# Altium project 6AxisEncoderFinARM.PrjPcb
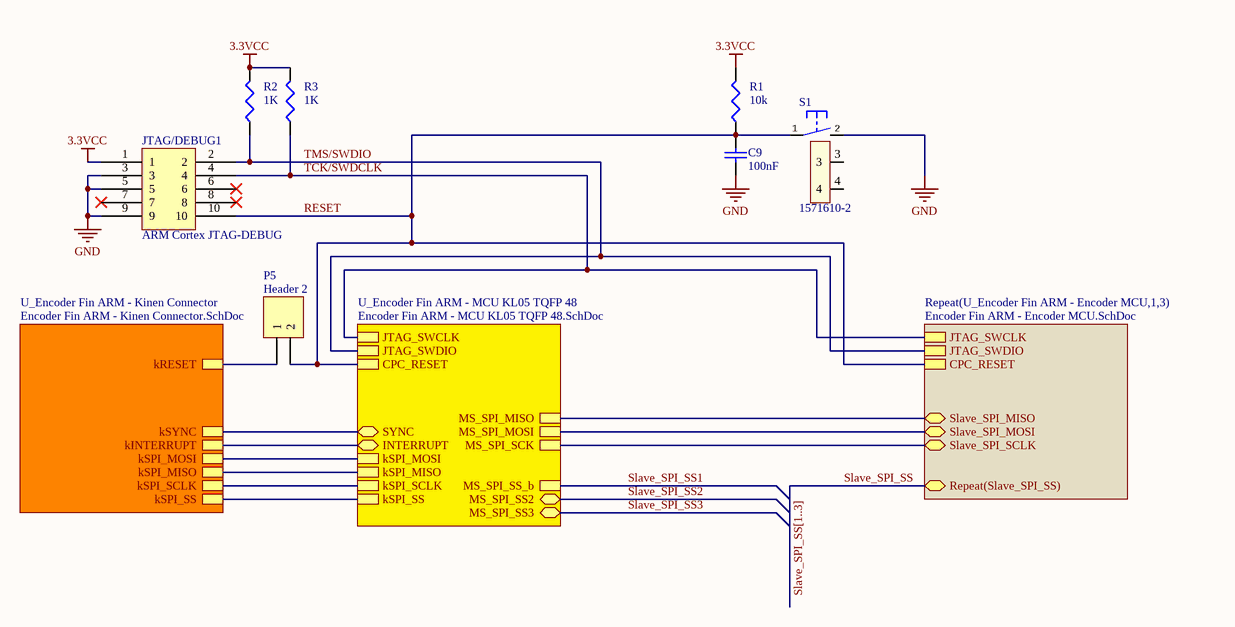
[diagram p0: Encoder Fin ARM - System.SchDoc]
4 sheets, 58 parts. Net scope: hierarchical (ports join the sheet entries above them; power ports are global).
Board file: SixAxisEncoderFinARM R1.0.PcbDoc
Sheets:
  Encoder Fin ARM - System.SchDoc
    U_Encoder Fin ARM - Encoder MCU1 = Encoder Fin ARM - Encoder MCU.SchDoc
    U_Encoder Fin ARM - Encoder MCU2 = Encoder Fin ARM - Encoder MCU.SchDoc
    U_Encoder Fin ARM - Encoder MCU3 = Encoder Fin ARM - Encoder MCU.SchDoc
    U_Encoder Fin ARM - MCU KL05 TQFP 48 = Encoder Fin ARM - MCU KL05 TQFP 48.SchDoc
    U_Encoder Fin ARM - Kinen Connector = Encoder Fin ARM - Kinen Connector.SchDoc

## Sheet Encoder Fin ARM - System.SchDoc
size B

### Parts
C9  value 100nF  [1608[0603]]  (hidden comment: Cap Semi)
JTAG/DEBUG1  ARM Cortex JTAG-DEBUG  [FTSH-105-XX-X-DV]
P5  Header 2  [HDR1X2]
R1  value 10k  [J1-0603]  (hidden comment: Res3)
R2  value 1K  [J1-0603]  (hidden comment: Res3)
R3  value 1K  [J1-0603]  (hidden comment: Res3)
S1  1571610-2  [B3F-31XX]

### Sub-sheets
Repeat(U_Encoder Fin ARM - Encoder MCU,1,3) = Encoder Fin ARM - Encoder MCU.SchDoc: JTAG_SWCLK, JTAG_SWDIO, CPC_RESET, Slave_SPI_MOSI, Slave_SPI_MISO, Slave_SPI_SCLK, Repeat(Slave_SPI_SS)
U_Encoder Fin ARM - Kinen Connector = Encoder Fin ARM - Kinen Connector.SchDoc: kSPI_MOSI, kSPI_MISO, kSPI_SCLK, kSPI_SS, kRESET, kINTERRUPT, kSYNC
U_Encoder Fin ARM - MCU KL05 TQFP 48 = Encoder Fin ARM - MCU KL05 TQFP 48.SchDoc: JTAG_SWCLK, JTAG_SWDIO, CPC_RESET, kSPI_MOSI, kSPI_MISO, kSPI_SCLK, kSPI_SS, MS_SPI_MISO, MS_SPI_SS_b, MS_SPI_MOSI, MS_SPI_SCK, MS_SPI_SS2, MS_SPI_SS3, INTERRUPT, SYNC

### Nets
3.3VCC: JTAG/DEBUG1.1 R1.2 R2.2 R3.2
GND: C9.1 JTAG/DEBUG1.3 JTAG/DEBUG1.5 JTAG/DEBUG1.9 S1.2(S)
kSPI_MISO: sheet U_Encoder Fin ARM - MCU KL05 TQFP 48/kSPI_MISO, sheet U_Encoder Fin ARM - Kinen Connector/kSPI_MISO
kSPI_MOSI: sheet U_Encoder Fin ARM - MCU KL05 TQFP 48/kSPI_MOSI, sheet U_Encoder Fin ARM - Kinen Connector/kSPI_MOSI
kSPI_SCLK: sheet U_Encoder Fin ARM - MCU KL05 TQFP 48/kSPI_SCLK, sheet U_Encoder Fin ARM - Kinen Connector/kSPI_SCLK
kSPI_SS: sheet U_Encoder Fin ARM - MCU KL05 TQFP 48/kSPI_SS, sheet U_Encoder Fin ARM - Kinen Connector/kSPI_SS
RESET: C9.2 JTAG/DEBUG1.10 P5.2 R1.1 S1.1(P) ; sheet Repeat(U_Encoder Fin ARM - Encoder MCU,1,3)/CPC_RESET, sheet U_Encoder Fin ARM - MCU KL05 TQFP 48/CPC_RESET
Slave_SPI_SS: sheet Repeat(U_Encoder Fin ARM - Encoder MCU,1,3)/Repeat(Slave_SPI_SS)
TCK/SWDCLK: JTAG/DEBUG1.4 R3.1 ; sheet Repeat(U_Encoder Fin ARM - Encoder MCU,1,3)/JTAG_SWCLK, sheet U_Encoder Fin ARM - MCU KL05 TQFP 48/JTAG_SWCLK
TMS/SWDIO: JTAG/DEBUG1.2 R2.1 ; sheet Repeat(U_Encoder Fin ARM - Encoder MCU,1,3)/JTAG_SWDIO, sheet U_Encoder Fin ARM - MCU KL05 TQFP 48/JTAG_SWDIO
NetK1_11: P5.1 ; sheet U_Encoder Fin ARM - Kinen Connector/kRESET
NetK1_13: sheet U_Encoder Fin ARM - MCU KL05 TQFP 48/SYNC, sheet U_Encoder Fin ARM - Kinen Connector/kSYNC
NetK1_14: sheet U_Encoder Fin ARM - MCU KL05 TQFP 48/INTERRUPT, sheet U_Encoder Fin ARM - Kinen Connector/kINTERRUPT
NetU1A_8: sheet Repeat(U_Encoder Fin ARM - Encoder MCU,1,3)/Slave_SPI_MOSI, sheet U_Encoder Fin ARM - MCU KL05 TQFP 48/MS_SPI_MOSI
NetU1A_11: sheet Repeat(U_Encoder Fin ARM - Encoder MCU,1,3)/Slave_SPI_MISO, sheet U_Encoder Fin ARM - MCU KL05 TQFP 48/MS_SPI_MISO
NetU1A_12: sheet Repeat(U_Encoder Fin ARM - Encoder MCU,1,3)/Slave_SPI_SCLK, sheet U_Encoder Fin ARM - MCU KL05 TQFP 48/MS_SPI_SCK

Not connected (* = marked no-connect by the designer): JTAG/DEBUG1 6* 7* 8*; S1 3 4

### Buses and harness runs
bus Slave_SPI_SS[1..3]

### Library data of the parts
C9 = Cap Semi: Capacitor (Semiconductor SIM Model); Published: 8-Jun-2000; LatestRevisionDate: 29-May-2009; LatestRevisionNote: IPC-7351 Footprint Added.; PackageReference: C1206; Publisher: Altium Limited; PackageDescription: Chip Capacitor
JTAG/DEBUG1 = ARM Cortex JTAG-DEBUG Header
P5 = Header 2: Header, 2-Pin; LatestRevisionDate: 17-Jul-2002; LatestRevisionNote: Re-released for DXP Platform.; Publisher: Altium Limited
R1-R3 = Res3: Resistor; Published: 8-Jun-2000; LatestRevisionDate: 29-May-2009; LatestRevisionNote: IPC-7351 Footprint Added.; PackageReference: J1-0603; Publisher: Altium Limited; PackageDescription: Chip Resistor
S1 = 1571610-2_1: SWTCH Momentary Washable; Manufacturer: Omron; Manufacturer: TE; LastRevisionNote: Import; ComponentLink1URL: http://www.te.com/commerce/DocumentDelivery/DDEController?Action=srchrtrv&DocNm=1571610&DocType=Customer+Drawing&DocLang=English; ComponentLink1Description: Datasheet for B3F-31XX; Published: 23-Apr-2014; Publisher: UltiMachine; LastRevisionDate: 23-Apr-2014; ManufacturerPartNumber: 1571610-2; Supplier 1: Mouser; Supplier Part Number 1: 506-1571610-2

## Sheet Encoder Fin ARM - Encoder MCU.SchDoc
size A
Used 3 times, as channels U_Encoder Fin ARM - Encoder MCU1, U_Encoder Fin ARM - Encoder MCU2, U_Encoder Fin ARM - Encoder MCU3. Parts and nets are listed once, with the designators drawn on the sheet.
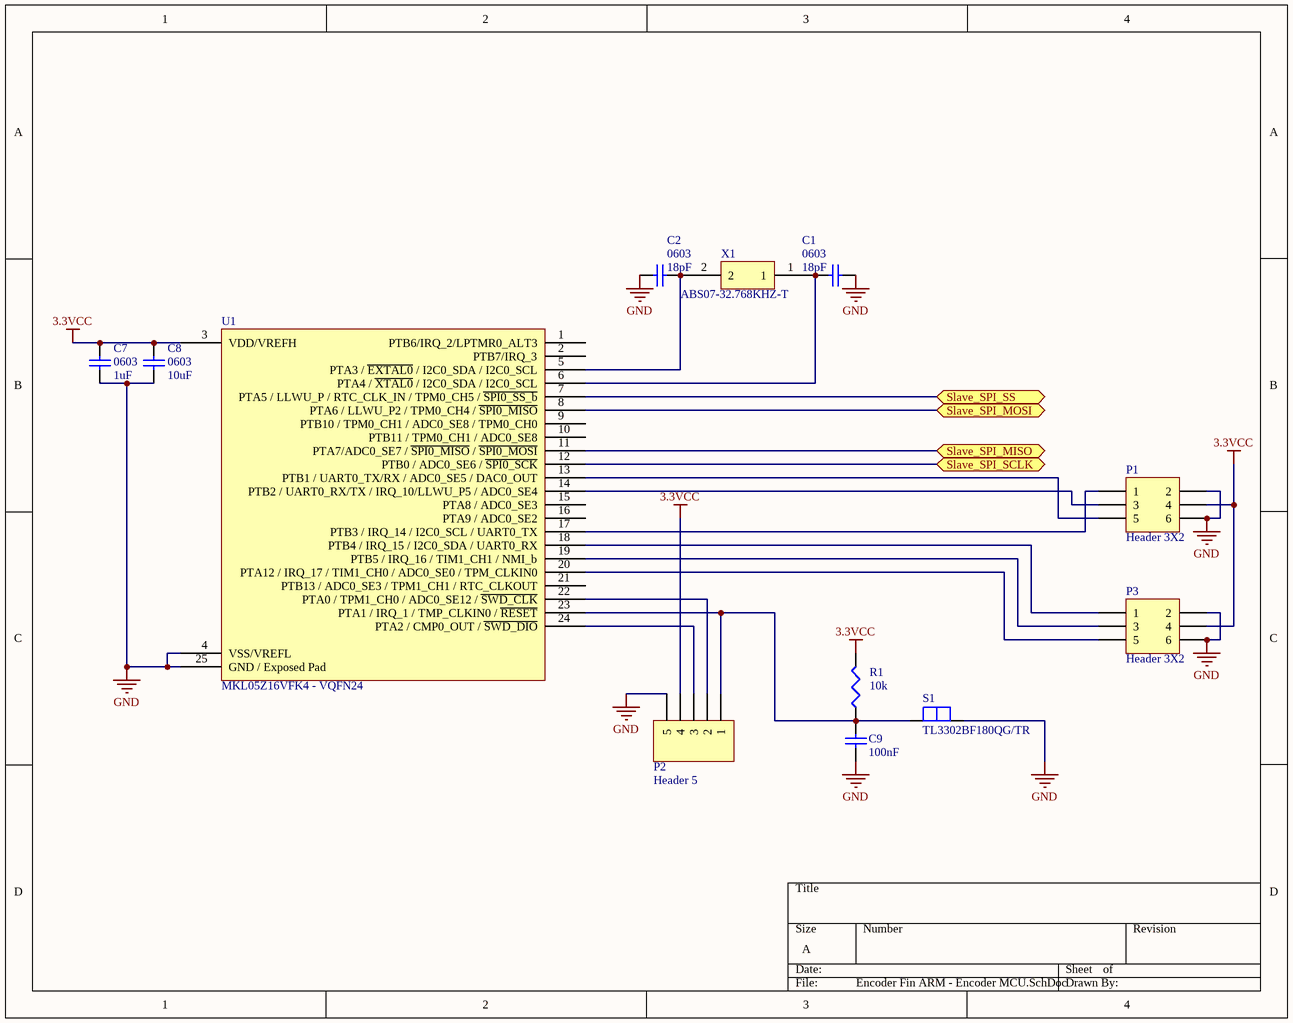
[diagram p1: Encoder Fin ARM - Encoder MCU.SchDoc]

### Parts
C1  0603  value 18pF  [1608[0603]]
C2  0603  value 18pF  [1608[0603]]
C7  0603  value 1uF  [1608[0603]]
C8  0603  value 10uF  [1608[0603]]
C9  value 100nF  [1608[0603]]  (hidden comment: Cap Semi)
P1  Header 3X2  [HDR2X3 Shrouded - Molex 0901301106]
P2  Header 5  [HDR1X5]
P3  Header 3X2  [HDR2X3 Shrouded - Molex 0901301106]
R1  value 10k  [J1-0603]  (hidden comment: Res3)
S1  TL3302BF180QG/TR  [TL3302BF180QG/TR]
U1  MKL05Z16VFK4 - VQFN24  [98ASA00474D]
X1  ABS07-32.768KHZ-T  [ABS07-32.768KHZ-T]

### Ports
Slave_SPI_MISO, Slave_SPI_MOSI, Slave_SPI_SCLK, Slave_SPI_SS

### Nets
3.3VCC: C7.2 C8.2 P1.4 P2.4 P3.4 R1.2 U1.3(VDD/VREFH)
GND: C1.2 C2.2 C7.1 C8.1 C9.1 P1.2 P1.6 P2.5 P3.2 P3.6 S1.2 U1.4(VSS/VREFL) U1.25(GND_/_Exposed_Pad)
Slave_SPI_MISO: U1.11(PTA7/ADC0_SE7_/_~{SPI0_MISO}_/_~{SPI0_MOSI}) ; port Slave_SPI_MISO
Slave_SPI_MOSI: U1.8(PTA6_/_LLWU_P2_/_TPM0_CH4_/_~{SPI0_MISO}) ; port Slave_SPI_MOSI
Slave_SPI_SCLK: U1.12(PTB0_/_ADC0_SE6_/_~{SPI0_SCK}) ; port Slave_SPI_SCLK
Slave_SPI_SS: U1.7(PTA5_/_LLWU_P_/_RTC_CLK_IN_/_TPM0_CH5_/_~{SPI0_SS_b}) ; port Slave_SPI_SS
NetC1_1: C1.1 U1.6(PTA4_/_~{XTAL0}_/_I2C0_SDA_/_I2C0_SCL) X1.1
NetC2_1: C2.1 U1.5(PTA3_/_~{EXTAL0}_/_I2C0_SDA_/_I2C0_SCL) X1.2
NetC9_2: C9.2 P2.1 R1.1 S1.1 U1.23(PTA1_/_IRQ_1_/_TMP_CLKIN0_/_~{RESET})
NetP1_1: P1.1 U1.17(PTB3_/_IRQ_14_/_I2C0_SCL_/_UART0_TX)
NetP1_3: P1.3 U1.14(PTB2_/_UART0_RX/TX_/_IRQ_10/LLWU_P5_/_ADC0_SE4)
NetP1_5: P1.5 U1.13(PTB1_/_UART0_TX/RX_/_ADC0_SE5_/_DAC0_OUT)
NetP2_2: P2.2 U1.22(PTA0_/_TPM1_CH0_/_ADC0_SE12_/_~{SWD_CLK})
NetP2_3: P2.3 U1.24(PTA2_/_CMP0_OUT_/_~{SWD_DIO})
NetP3_1: P3.1 U1.18(PTB4_/_IRQ_15_/_I2C0_SDA_/_UART0_RX)
NetP3_3: P3.3 U1.19(PTB5_/_IRQ_16_/_TIM1_CH1_/_NMI_b)
NetP3_5: P3.5 U1.20(PTA12_/_IRQ_17_/_TIM1_CH0_/_ADC0_SE0_/_TPM_CLKIN0)

Not connected (* = marked no-connect by the designer): U1 1(PTB6/IRQ_2/LPTMR0_ALT3) 2(PTB7/IRQ_3) 9(PTB10_/_TPM0_CH1_/_ADC0_SE8_/_TPM0_CH0) 10(PTB11_/_TPM0_CH1_/_ADC0_SE8) 15(PTA8_/_ADC0_SE3) 16(PTA9_/_ADC0_SE2) 21(PTB13_/_ADC0_SE3_/_TPM1_CH1_/_RTC_CLKOUT)

### Channels
U_Encoder Fin ARM - Encoder MCU1: designators end in A; ports Slave_SPI_MISO=NetU1A_11 Slave_SPI_MOSI=NetU1A_8 Slave_SPI_SCLK=NetU1A_12 Slave_SPI_SS=Slave_SPI_SS1
U_Encoder Fin ARM - Encoder MCU2: designators end in B; ports Slave_SPI_MISO=NetU1A_11 Slave_SPI_MOSI=NetU1A_8 Slave_SPI_SCLK=NetU1A_12 Slave_SPI_SS=B_DECO
U_Encoder Fin ARM - Encoder MCU3: designators end in C; ports Slave_SPI_MISO=NetU1A_11 Slave_SPI_MOSI=NetU1A_8 Slave_SPI_SCLK=NetU1A_12 Slave_SPI_SS=Slave_SPI_SS3

### Library data of the parts
C1 C2 C7-C9 = Cap Semi: Capacitor (Semiconductor SIM Model); Published: 8-Jun-2000; LatestRevisionDate: 29-May-2009; LatestRevisionNote: IPC-7351 Footprint Added.; PackageReference: C1206; Publisher: Altium Limited; PackageDescription: Chip Capacitor
P1 P3 = Header 3X2: Header, 3-Pin, Dual row; LatestRevisionDate: 17-Jul-2002; LatestRevisionNote: Re-released for DXP Platform.; Publisher: Altium Limited
P2 = Header 5: Header, 5-Pin; LatestRevisionDate: 17-Jul-2002; LatestRevisionNote: Re-released for DXP Platform.; Publisher: Altium Limited
R1 = Res3: Resistor; Published: 8-Jun-2000; LatestRevisionDate: 29-May-2009; LatestRevisionNote: IPC-7351 Footprint Added.; PackageReference: J1-0603; Publisher: Altium Limited; PackageDescription: Chip Resistor
S1 = TL3302BF180QG/TR: Tactile Switch Tiny
U1 = MKL05Z16VFK4 - 24 Pin VQFN: ARM Cortex M0+
X1 = ABS07-32.768KHZ-T: ABS07-32.768KHZ-T RTC Crystal Oscillator

## Sheet Encoder Fin ARM - MCU KL05 TQFP 48.SchDoc
size A
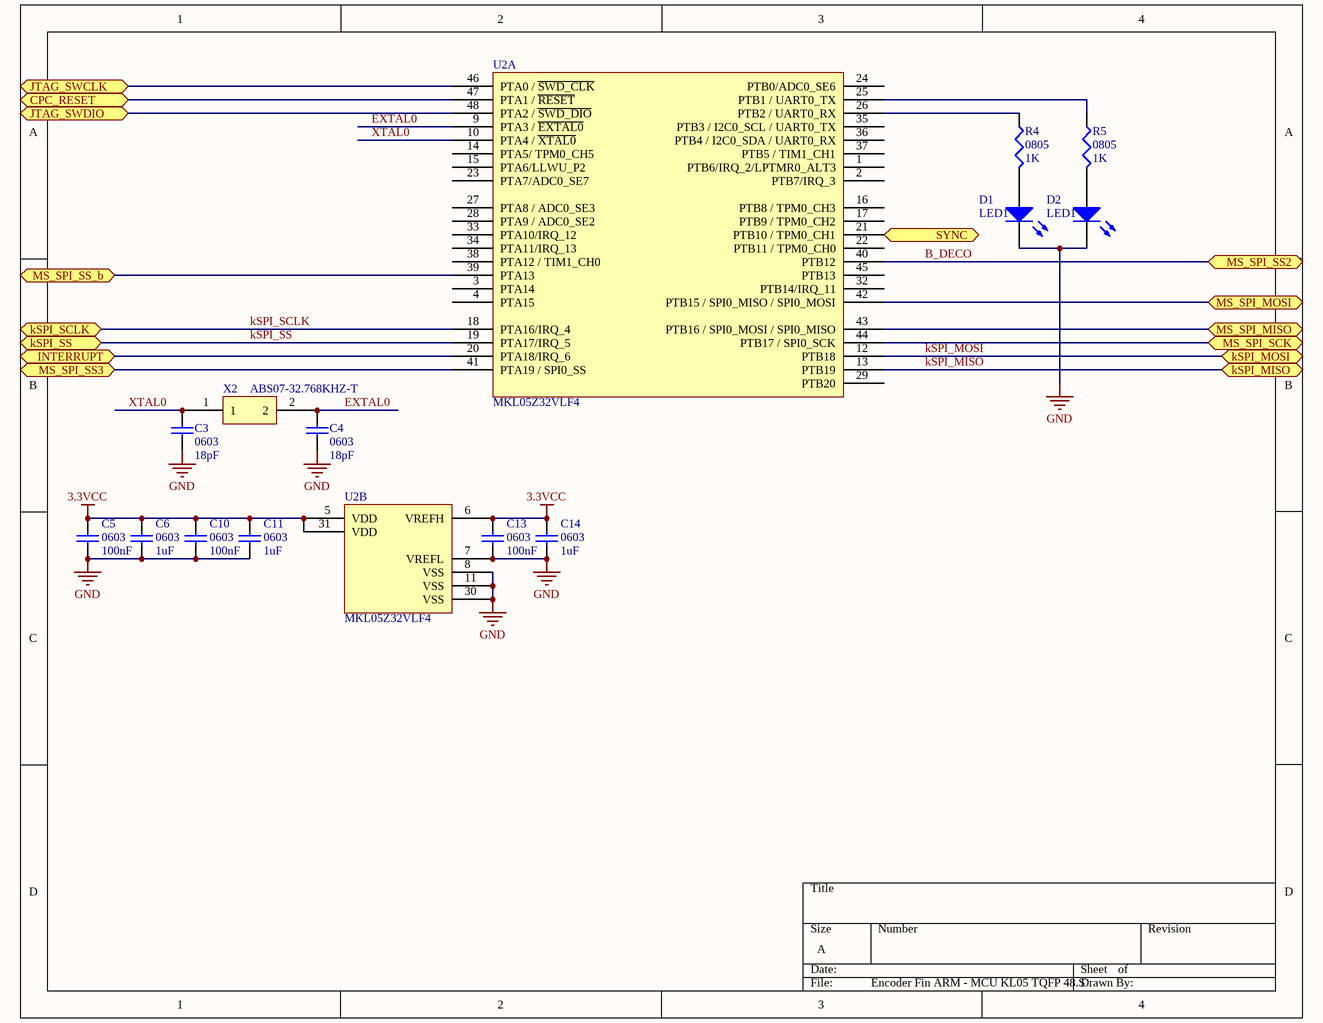
[diagram p2: Encoder Fin ARM - MCU KL05 TQFP 48.SchDoc]

### Parts
C3  0603  value 18pF  [1608[0603]]
C4  0603  value 18pF  [1608[0603]]
C5  0603  value 100nF  [1608[0603]]
C6  0603  value 1uF  [1608[0603]]
C10  0603  value 100nF  [1608[0603]]
C11  0603  value 1uF  [1608[0603]]
C13  0603  value 100nF  [1608[0603]]
C14  0603  value 1uF  [1608[0603]]
D1  LED1  [SM 0805 polarized]
D2  LED1  [SM 0805 polarized]
R4  0805  value 1K  [SM 0805 - gap trimmed]
R5  0805  value 1K  [SM 0805 - gap trimmed]
U2  MKL05Z32VLF4  [MKL05Z32VLF4]  (parts A,B of 2)
X2  ABS07-32.768KHZ-T  [ABS07-32.768KHZ-T]

### Ports
CPC_RESET, INTERRUPT, JTAG_SWCLK, JTAG_SWDIO, kSPI_MISO, kSPI_MOSI, kSPI_SCLK, kSPI_SS, MS_SPI_MISO, MS_SPI_MOSI, MS_SPI_SCK, MS_SPI_SS2, MS_SPI_SS3, MS_SPI_SS_b, SYNC

### Nets
3.3VCC: C5.2 C6.2 C10.2 C11.2 C13.1 C14.1 U2.5(VDD) U2.6(VREFH) U2.31(VDD)
GND: C3.2 C4.2 C5.1 C6.1 C10.1 C11.1 C13.2 C14.2 D1.1(A) D2.1(A) U2.7(VREFL) U2.8(VSS) U2.11(VSS) U2.30(VSS)
B_DECO: U2.40(PTB12) ; port MS_SPI_SS2
EXTAL0: C4.1 U2.9(PTA3_/_~{EXTAL0}) X2.2
kSPI_MISO: U2.13(PTB19) ; port kSPI_MISO
kSPI_MOSI: U2.12(PTB18) ; port kSPI_MOSI
kSPI_SCLK: U2.18(PTA16/IRQ_4) ; port kSPI_SCLK
kSPI_SS: U2.19(PTA17/IRQ_5) ; port kSPI_SS
RESET: U2.47(PTA1_/_~{RESET}) ; port CPC_RESET
Slave_SPI_SS1: U2.39(PTA13) ; port MS_SPI_SS_b
Slave_SPI_SS3: U2.41(PTA19_/_SPI0_SS) ; port MS_SPI_SS3
TCK/SWDCLK: U2.46(PTA0_/_~{SWD_CLK}) ; port JTAG_SWCLK
TMS/SWDIO: U2.48(PTA2_/_~{SWD_DIO}) ; port JTAG_SWDIO
XTAL0: C3.1 U2.10(PTA4_/_~{XTAL0}) X2.1
NetD1_2: D1.2(K) R4.2
NetD2_2: D2.2(K) R5.2
NetK1_13: U2.21(PTB10_/_TPM0_CH1) ; port SYNC
NetK1_14: U2.20(PTA18/IRQ_6) ; port INTERRUPT
NetR4_1: R4.1 U2.26(PTB2_/_UART0_RX)
NetR5_1: R5.1 U2.25(PTB1_/_UART0_TX)
NetU1A_8: U2.42(PTB15_/_SPI0_MISO_/_SPI0_MOSI) ; port MS_SPI_MOSI
NetU1A_11: U2.43(PTB16_/_SPI0_MOSI_/_SPI0_MISO) ; port MS_SPI_MISO
NetU1A_12: U2.44(PTB17_/_SPI0_SCK) ; port MS_SPI_SCK

Not connected (* = marked no-connect by the designer): U2 1(PTB6/IRQ_2/LPTMR0_ALT3) 2(PTB7/IRQ_3) 3(PTA14) 4(PTA15) 14(PTA5/_TPM0_CH5) 15(PTA6/LLWU_P2) 16(PTB8_/_TPM0_CH3) 17(PTB9_/_TPM0_CH2) 22(PTB11_/_TPM0_CH0) 23(PTA7/ADC0_SE7) 24(PTB0/ADC0_SE6) 27(PTA8_/_ADC0_SE3) 28(PTA9_/_ADC0_SE2) 29(PTB20) 32(PTB14/IRQ_11) 33(PTA10/IRQ_12) 34(PTA11/IRQ_13) 35(PTB3_/_I2C0_SCL_/_UART0_TX) 36(PTB4_/_I2C0_SDA_/_UART0_RX) 37(PTB5_/_TIM1_CH1) 38(PTA12_/_TIM1_CH0) 45(PTB13)

### Library data of the parts
C3-C6 C10 C11 C13 C14 = Cap Semi: Capacitor (Semiconductor SIM Model); Published: 8-Jun-2000; LatestRevisionDate: 29-May-2009; LatestRevisionNote: IPC-7351 Footprint Added.; PackageReference: C1206; Publisher: Altium Limited; PackageDescription: Chip Capacitor
D1 D2 = LED1: Typical RED GaAs LED; Published: 8-Jun-2000; LatestRevisionDate: 08-Jul-2005; LatestRevisionNote: Mech Layer 1 removed.; PackageReference: LED-1; Publisher: Altium Limited; PackageDescription: LED; 2 Leads
R4 R5 = Res3: Resistor; Published: 8-Jun-2000; LatestRevisionDate: 29-May-2009; LatestRevisionNote: IPC-7351 Footprint Added.; PackageReference: J1-0603; Publisher: Altium Limited; PackageDescription: Chip Resistor
U2 = MKL05Z32VLF4: ARM Cortex M0+
X2 = ABS07-32.768KHZ-T: ABS07-32.768KHZ-T RTC Crystal Oscillator

## Sheet Encoder Fin ARM - Kinen Connector.SchDoc
size A
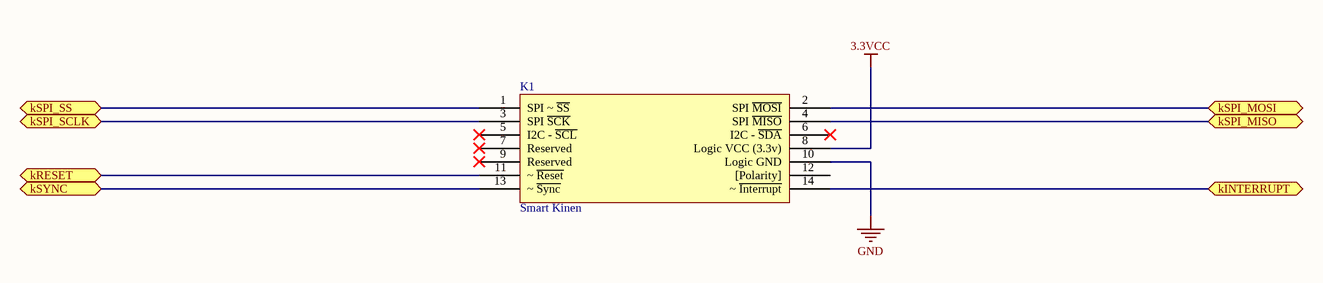
[diagram p3: Encoder Fin ARM - Kinen Connector.SchDoc]

### Parts
K1  Smart Kinen  [Kinen Fin - Smart Device]

### Ports
kINTERRUPT, kRESET, kSPI_MISO, kSPI_MOSI, kSPI_SCLK, kSPI_SS, kSYNC

### Nets
3.3VCC: K1.8(Logic_VCC_(3.3v))
GND: K1.10(Logic_GND)
kSPI_MISO: K1.4(SPI_~{MISO}) ; port kSPI_MISO
kSPI_MOSI: K1.2(SPI_~{MOSI}) ; port kSPI_MOSI
kSPI_SCLK: K1.3(SPI_~{SCK}) ; port kSPI_SCLK
kSPI_SS: K1.1(SPI_~_~{SS}) ; port kSPI_SS
NetK1_11: K1.11(~_~{Reset}) ; port kRESET
NetK1_13: K1.13(~_~{Sync}) ; port kSYNC
NetK1_14: K1.14(~_~{Interrupt}) ; port kINTERRUPT

Not connected (* = marked no-connect by the designer): K1 5(I2C_-_~{SCL})* 6(I2C_-_~{SDA})* 7(Reserved)* 9(Reserved)* 12([Polarity])

### Library data of the parts
K1 = Kinen Device NEW Smart

## Nets that join several sheets
3.3VCC: Encoder Fin ARM - System (JTAG/DEBUG1.1 R1.2 R2.2 R3.2), U_Encoder Fin ARM - Encoder MCU1 (7 pins), U_Encoder Fin ARM - Encoder MCU2 (7 pins), U_Encoder Fin ARM - Encoder MCU3 (7 pins), Encoder Fin ARM - MCU KL05 TQFP 48 (9 pins), Encoder Fin ARM - Kinen Connector (K1.8)
GND: Encoder Fin ARM - System (5 pins), U_Encoder Fin ARM - Encoder MCU1 (13 pins), U_Encoder Fin ARM - Encoder MCU2 (13 pins), U_Encoder Fin ARM - Encoder MCU3 (13 pins), Encoder Fin ARM - MCU KL05 TQFP 48 (14 pins), Encoder Fin ARM - Kinen Connector (K1.10)
B_DECO: U_Encoder Fin ARM - Encoder MCU2 (U1B.7), Encoder Fin ARM - MCU KL05 TQFP 48 (U2.40)
kSPI_MISO: Encoder Fin ARM - MCU KL05 TQFP 48 (U2.13), Encoder Fin ARM - Kinen Connector (K1.4)
kSPI_MOSI: Encoder Fin ARM - MCU KL05 TQFP 48 (U2.12), Encoder Fin ARM - Kinen Connector (K1.2)
kSPI_SCLK: Encoder Fin ARM - MCU KL05 TQFP 48 (U2.18), Encoder Fin ARM - Kinen Connector (K1.3)
kSPI_SS: Encoder Fin ARM - MCU KL05 TQFP 48 (U2.19), Encoder Fin ARM - Kinen Connector (K1.1)
NetK1_11: Encoder Fin ARM - System (P5.1), Encoder Fin ARM - Kinen Connector (K1.11)
NetK1_13: Encoder Fin ARM - MCU KL05 TQFP 48 (U2.21), Encoder Fin ARM - Kinen Connector (K1.13)
NetK1_14: Encoder Fin ARM - MCU KL05 TQFP 48 (U2.20), Encoder Fin ARM - Kinen Connector (K1.14)
NetU1A_8: U_Encoder Fin ARM - Encoder MCU1 (U1A.8), U_Encoder Fin ARM - Encoder MCU2 (U1B.8), U_Encoder Fin ARM - Encoder MCU3 (U1C.8), Encoder Fin ARM - MCU KL05 TQFP 48 (U2.42)
NetU1A_11: U_Encoder Fin ARM - Encoder MCU1 (U1A.11), U_Encoder Fin ARM - Encoder MCU2 (U1B.11), U_Encoder Fin ARM - Encoder MCU3 (U1C.11), Encoder Fin ARM - MCU KL05 TQFP 48 (U2.43)
NetU1A_12: U_Encoder Fin ARM - Encoder MCU1 (U1A.12), U_Encoder Fin ARM - Encoder MCU2 (U1B.12), U_Encoder Fin ARM - Encoder MCU3 (U1C.12), Encoder Fin ARM - MCU KL05 TQFP 48 (U2.44)
RESET: Encoder Fin ARM - System (5 pins), Encoder Fin ARM - MCU KL05 TQFP 48 (U2.47)
Slave_SPI_SS1: U_Encoder Fin ARM - Encoder MCU1 (U1A.7), Encoder Fin ARM - MCU KL05 TQFP 48 (U2.39)
Slave_SPI_SS3: U_Encoder Fin ARM - Encoder MCU3 (U1C.7), Encoder Fin ARM - MCU KL05 TQFP 48 (U2.41)
TCK/SWDCLK: Encoder Fin ARM - System (JTAG/DEBUG1.4 R3.1), Encoder Fin ARM - MCU KL05 TQFP 48 (U2.46)
TMS/SWDIO: Encoder Fin ARM - System (JTAG/DEBUG1.2 R2.1), Encoder Fin ARM - MCU KL05 TQFP 48 (U2.48)